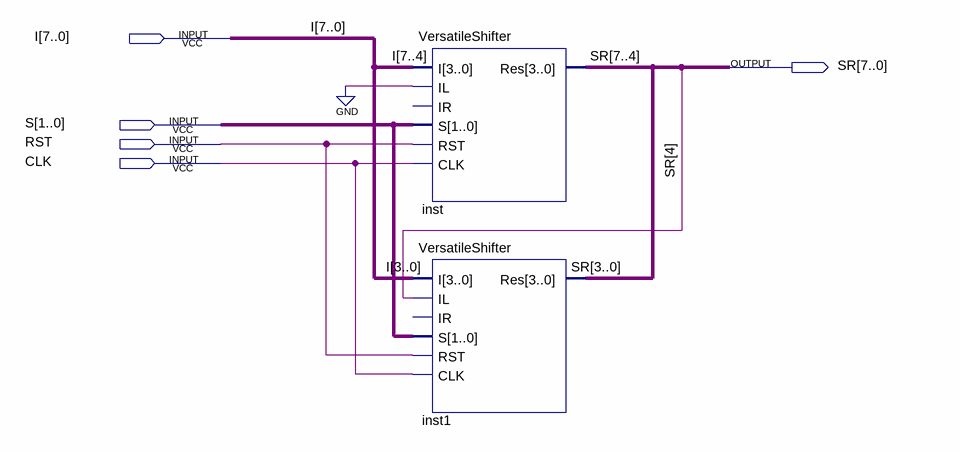
[diagram p0: schematic sheet]
// Quartus schematic 8SR.bdf as structural Verilog: 2 symbols, 5 pins
module \8SR  (
  input  [7:0] I,
  input  [1:0] S,
  input  RST,
  input  CLK,
  output [7:0] SR
);

  VersatileShifter inst (.I(I[7:4]), .IL(1'b0), .S(S), .RST(RST), .CLK(CLK), .Res(SR[7:4]));  // open: IR
  VersatileShifter inst1 (.I(I[3:0]), .IL(SR[4]), .S(S), .RST(RST), .CLK(CLK), .Res(SR[3:0]));  // open: IR
endmodule
